# EAGLE design expansionBoard (EAGLE 7.7.0)
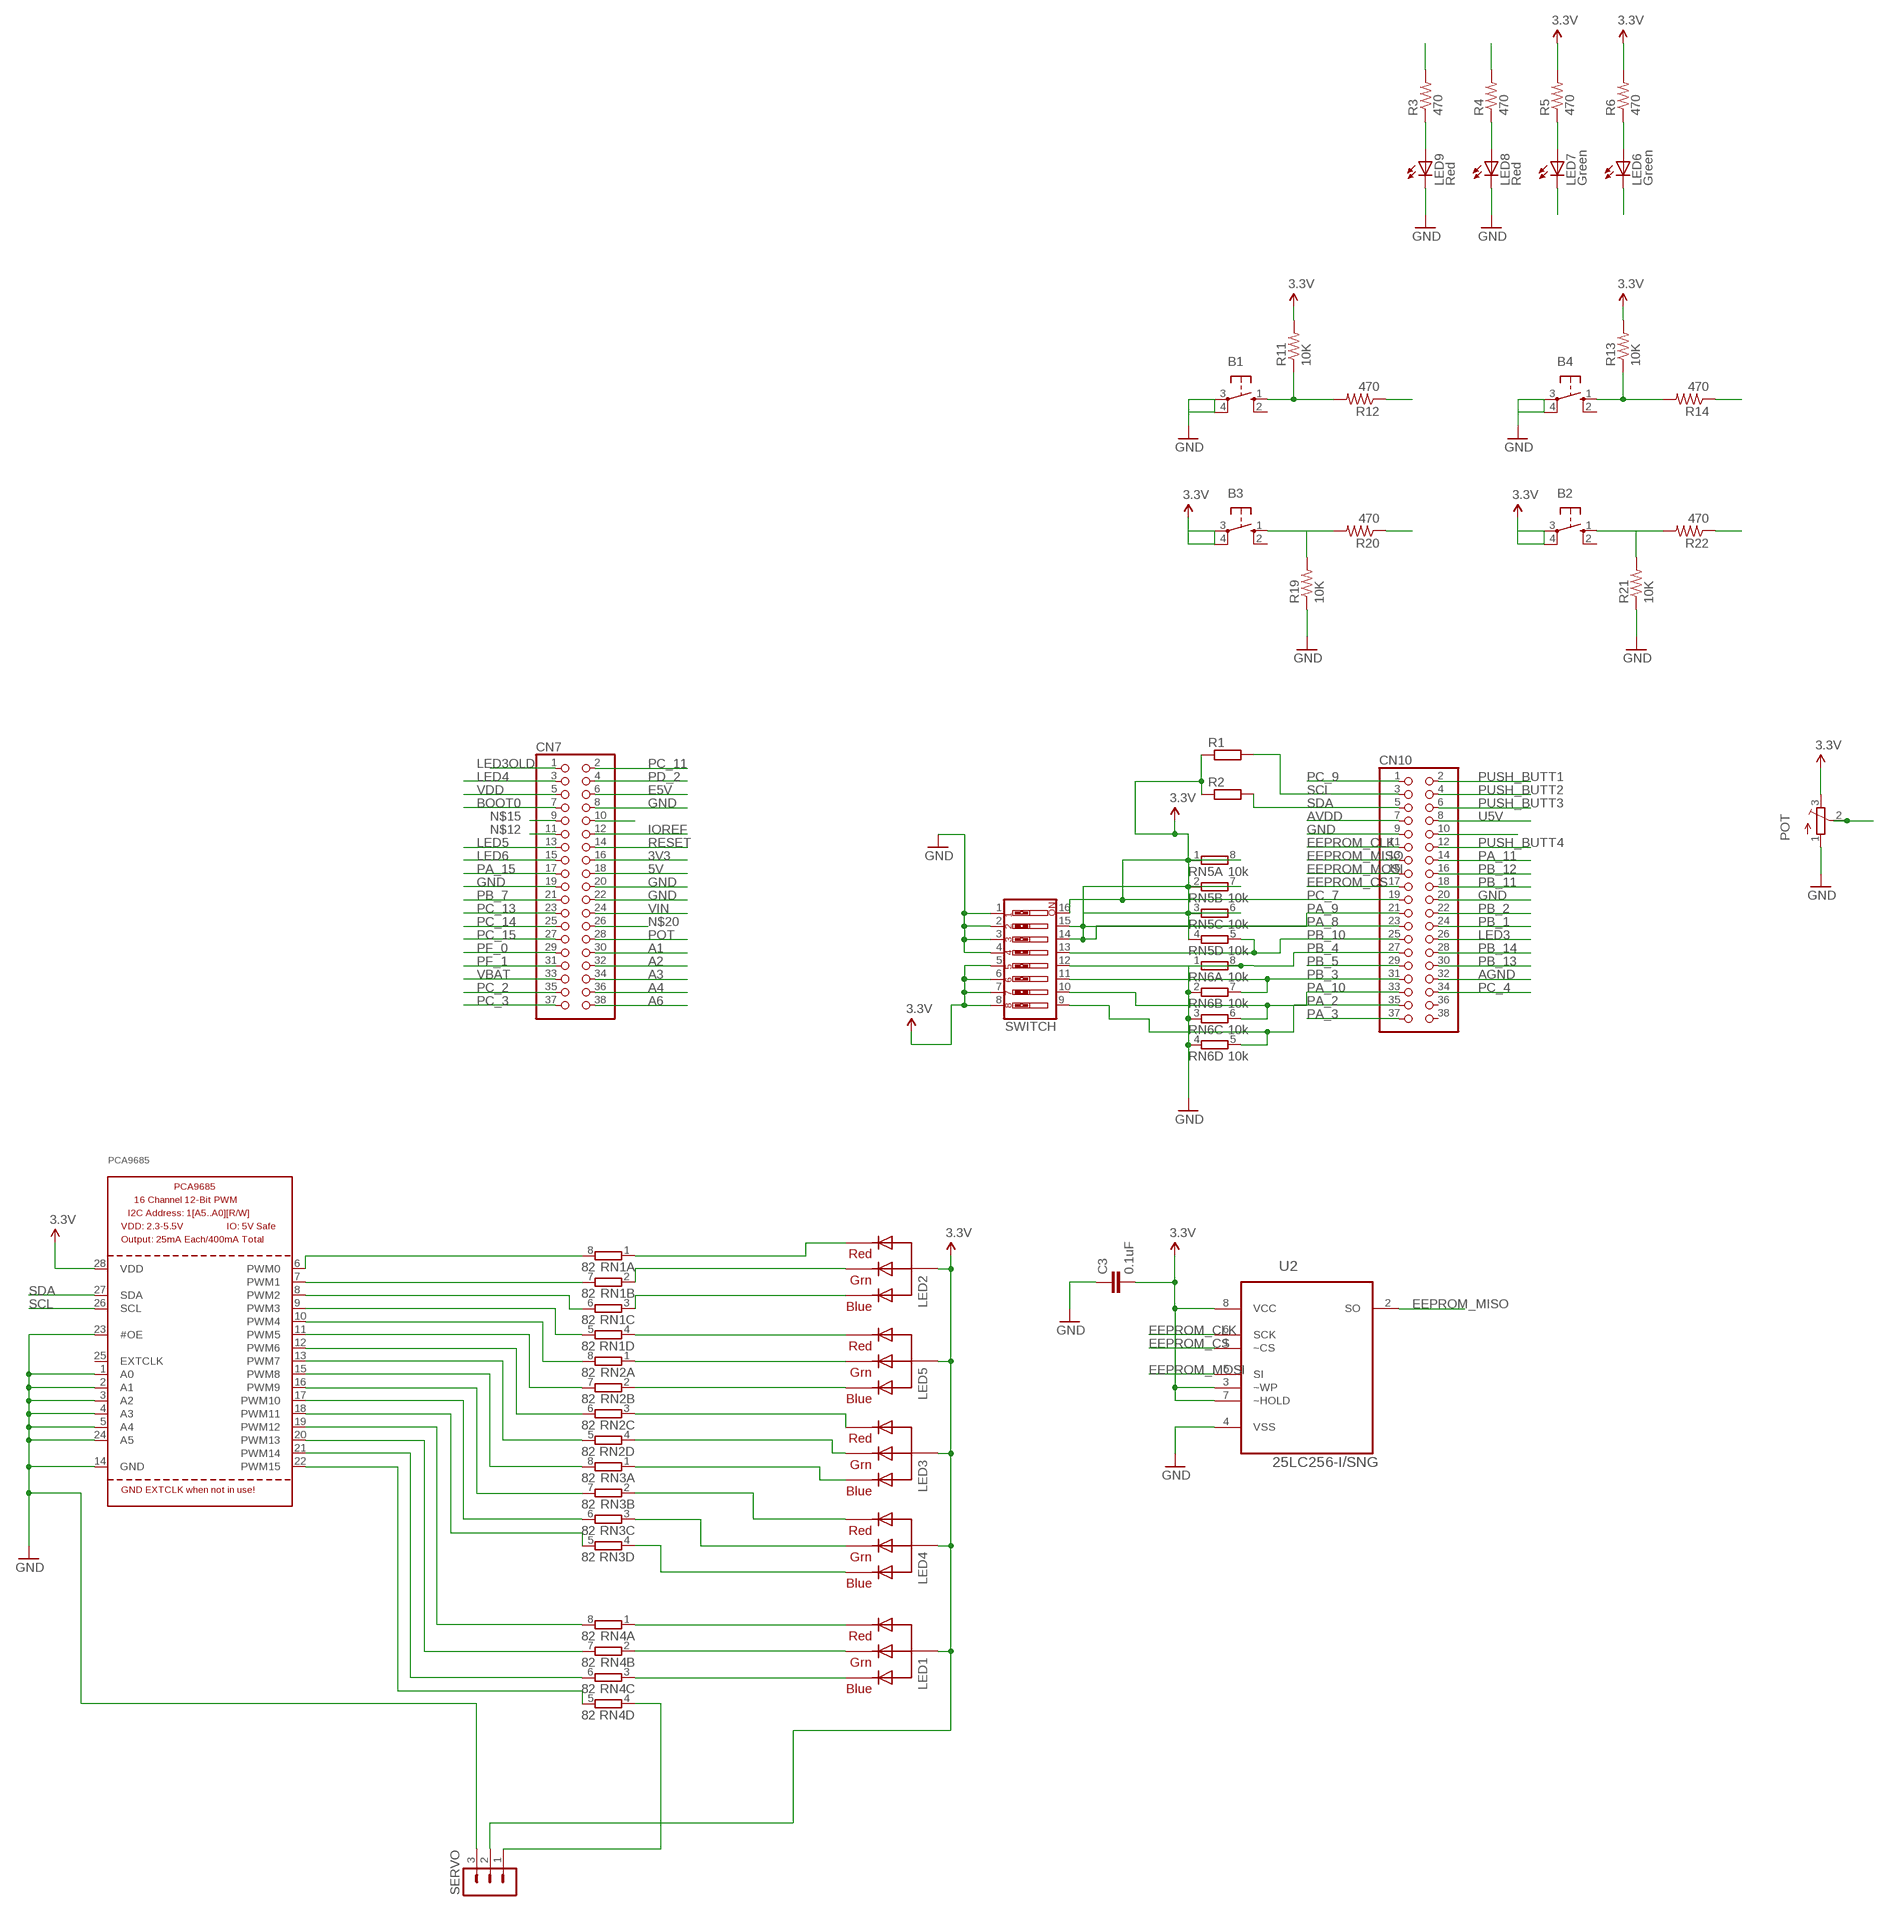
[diagram p0: schematic, sheet 1]

## Parts
B1  10-XX  [B3F-10XX]
B2  10-XX  [B3F-10XX]
B3  10-XX  [B3F-10XX]
B4  10-XX  [B3F-10XX]
C3  0.1uF  CAP0402-CAP  [0402-CAP]
CN7  PINHD-2X19  [2X19]
CN10  PINHD-2X19  [2X19]
LED1  RGBLED_CA-5MM  [LED5MMRGB]
LED2  RGBLED_CA-5MM  [LED5MMRGB]
LED3  RGBLED_CA-5MM  [LED5MMRGB]
LED4  RGBLED_CA-5MM  [LED5MMRGB]
LED5  RGBLED_CA-5MM  [LED5MMRGB]
LED6  Green  LED0603  [LED-0603]
LED7  Green  LED0603  [LED-0603]
LED8  Red  LED0603  [LED-0603]
LED9  Red  LED0603  [LED-0603]
PCA9685  PCA9685  [TSSOP28]
POT  TRIMPOT3386  [TRIM-3386]
R1  RR0603  [R0603]
R2  RR0603  [R0603]
R3  470  RESISTOR0402-RES  [0402-RES]
R4  470  RESISTOR0402-RES  [0402-RES]
R5  470  RESISTOR0402-RES  [0402-RES]
R6  470  RESISTOR0402-RES  [0402-RES]
R11  10K  RESISTOR0402-RES  [0402-RES]
R12  470  RESISTOR0402-RES  [0402-RES]
R13  10K  RESISTOR0402-RES  [0402-RES]
R14  470  RESISTOR0402-RES  [0402-RES]
R19  10K  RESISTOR0402-RES  [0402-RES]
R20  470  RESISTOR0402-RES  [0402-RES]
R21  10K  RESISTOR0402-RES  [0402-RES]
R22  470  RESISTOR0402-RES  [0402-RES]
RN1  82  4R-N0603-ARC  [0603-ARC]
RN2  82  4R-N0603-ARC  [0603-ARC]
RN3  82  4R-N0603-ARC  [0603-ARC]
RN4  82  4R-N0603-ARC  [0603-ARC]
RN5  10k  4R-N0603-ARC  [0603-ARC]
RN6  10k  4R-N0603-ARC  [0603-ARC]
SERVO  MA03-1  [MA03-1]
SWITCH  SW_DIP-8  [EDG-08]
U2  25LC256-I/SNG  [SOIC127P600X175-8N]

## Nets
3V3: CN7.16
5V: CN7.18
A1: CN7.30
A2: CN7.32
A3: CN7.34
A4: CN7.36
A6: CN7.38
AGND: CN10.32
AVDD: CN10.7
BOOT0: CN7.7
E5V: CN7.6
EEPROM_CLK: CN10.11 U2.6(SCK)
EEPROM_CS: CN10.17 U2.1(~CS)
EEPROM_MISO: CN10.13 U2.2(SO)
EEPROM_MOSI: CN10.15 U2.5(SI)
GND [power]: B1.3(P) B1.4(P1) B4.3(P) B4.4(P1) C3.1 CN7.8 CN7.19 CN7.20 CN7.22 CN10.9 CN10.20 LED8.C LED9.C PCA9685.1(A0) PCA9685.2(A1) PCA9685.3(A2) PCA9685.4(A3) PCA9685.5(A4) PCA9685.14(GND) PCA9685.23(#OE) PCA9685.24(A5) POT.1(A) R19.1 R21.1 RN6.1 RN6.2 RN6.3 RN6.4 SERVO.3 SWITCH.1 SWITCH.2 SWITCH.3 SWITCH.4 U2.4(VSS)
IOREF: CN7.12
LED3: CN10.26 R3.2
LED3OLD: CN7.1
LED4: CN7.3 R4.2
LED5: CN7.13 LED7.C
LED6: CN7.15 LED6.C
N$1: PCA9685.6(PWM0) RN1.8
N$2: PCA9685.7(PWM1) RN1.7
N$3: LED9.A R3.1
N$4: LED8.A R4.1
N$5: LED2.1(RED) RN1.1
N$6: PCA9685.8(PWM2) RN1.6
N$7: LED7.A R5.1
N$8: LED6.A R6.1
N$9: LED2.4(BLUE) RN1.3
N$10: PCA9685.9(PWM3) RN1.5
N$11: CN10.10
N$12: CN7.11
N$13: PCA9685.10(PWM4) RN2.8
N$14: PCA9685.11(PWM5) RN2.7
N$15: CN7.9
N$16: CN7.10
N$17: PCA9685.12(PWM6) RN2.6
N$18: PCA9685.13(PWM7) RN2.5
N$19: PCA9685.15(PWM8) RN3.8
N$20: CN7.26
N$21: PCA9685.16(PWM9) RN3.7
N$22: PCA9685.17(PWM10) RN3.6
N$23: PCA9685.18(PWM11) RN3.5
N$24: B4.1(S) R13.1 R14.2
N$25: B1.1(S) R11.1 R12.2
N$26: R14.1
N$27: R12.1
N$28: PCA9685.19(PWM12) RN4.8
N$29: PCA9685.20(PWM13) RN4.7
N$30: PCA9685.21(PWM14) RN4.6
N$31: LED2.3(GREEN) RN1.2
N$32: B3.1(S) R19.2 R20.2
N$33: R20.1
N$34: B2.1(S) R21.2 R22.2
N$35: R22.1
N$36: PCA9685.22(PWM15) RN4.5
N$37: RN4.4 SERVO.1
N$38: LED1.4(BLUE) RN4.3
N$39: LED1.3(GREEN) RN4.2
N$40: LED1.1(RED) RN4.1
N$41: LED5.1(RED) RN1.4
N$42: LED5.3(GREEN) RN2.1
N$43: LED5.4(BLUE) RN2.2
N$44: LED3.1(RED) RN2.3
N$45: LED3.3(GREEN) RN2.4
N$46: LED3.4(BLUE) RN3.1
N$47: LED4.1(RED) RN3.2
N$48: LED4.3(GREEN) RN3.3
N$49: LED4.4(BLUE) RN3.4
PA_2: CN10.35 RN6.5 SWITCH.9
PA_3: CN10.37
PA_8: CN10.23 RN5.6 SWITCH.14
PA_9: CN10.21 RN5.7 SWITCH.15
PA_10: CN10.33 RN6.6 SWITCH.10
PA_11: CN10.14
PA_15: CN7.17
PB_1: CN10.24
PB_2: CN10.22
PB_3: CN10.31 RN6.7 SWITCH.11
PB_4: CN10.27 RN6.8 SWITCH.12
PB_5: CN10.29
PB_7: CN7.21
PB_10: CN10.25 RN5.5 SWITCH.13
PB_11: CN10.18
PB_12: CN10.16
PB_13: CN10.30
PB_14: CN10.28
PC_2: CN7.35
PC_3: CN7.37
PC_4: CN10.34
PC_7: CN10.19 RN5.8 SWITCH.16
PC_9: CN10.1
PC_11: CN7.2
PC_13: CN7.23
PC_14: CN7.25
PC_15: CN7.27
PD_2: CN7.4
PF_0: CN7.29
PF_1: CN7.31
POT: CN7.28 POT.2(S)
PUSH_BUTT1: CN10.2
PUSH_BUTT2: CN10.4
PUSH_BUTT3: CN10.6
PUSH_BUTT4: CN10.12
RESET: CN7.14
SCL: CN10.3 PCA9685.26(SCL) R1.2
SDA: CN10.5 PCA9685.27(SDA) R2.2
U5V: CN10.8
VBAT: CN7.33
VCC: B2.3(P) B2.4(P1) B3.3(P) B3.4(P1) C3.2 LED1.2(VCC) LED2.2(VCC) LED3.2(VCC) LED4.2(VCC) LED5.2(VCC) PCA9685.28(VDD) POT.3(E) R1.1 R2.1 R5.2 R6.2 R11.2 R13.2 RN5.1 RN5.2 RN5.3 RN5.4 SERVO.2 SWITCH.5 SWITCH.6 SWITCH.7 SWITCH.8 U2.3(~WP) U2.7(~HOLD) U2.8(VCC) ; supply symbol labelled 3.3V
VDD: CN7.5
VIN: CN7.24
Unconnected: B1.2(S1) B2.2(S1) B3.2(S1) B4.2(S1) CN10.36 CN10.38 PCA9685.25(EXTCLK)

## Library data of the parts
B1-B4 = switch-omron:10-XX: OMRON SWITCH; MPN: B3F-1000; OC_FARNELL: 176432; OC_NEWARK: 36M3542
C3 = SparkFun:CAP: Capacitor Standard 0603 ceramic capacitor, and 0.1" leaded capacitor.
CN7 CN10 = pinhead:PINHD-2X19: PIN HEADER
LED1-LED5 = NucleoShield:RGBLED_CA: RGB LED, common-anode 5MM Staggered pins 5mm Piranha package http://www.ladyada.net/library/pcb/eaglelibrary.html
LED6-LED9 = SparkFun:LED: LEDs Standard schematic elements and footprints for 5mm, 3mm, 1206, and 0603 sized LEDs. 5mm - Spark Fun Electronics SKU : COM-00529 (and others)
PCA9685 = NucleoShield:PCA9685: PCA9685 - 16 Channel 12-Bit I2C PWM Controller 5.0V tolerant 16 channel, 12-bit I2C PWM controller with 25mA per output (max. 400mA total) Digikey: 568-5931-1-ND
POT = NucleoShield:TRIMPOT: SMT trimmer potentiometer part number TC33X http://www.ladyada.net/library/eagle
R1 R2 = eagle-ltspice:R: RESISTOR, European symbol; SPICEMODEL: NONE; SPICEPREFIX: R
R3-R6 R11-R14 R19-R22 = SparkFun:RESISTOR: Resistor Basic schematic elements and footprints for 0603, 1206, and PTH resistors.
RN1-RN6 = resistor-dil:4R-N: Array Chip Resistor Source: RS Component / Phycomp; OC_FARNELL: unknown; OC_NEWARK: unknown
SERVO = con-lstb:MA03-1: PIN HEADER; OC_FARNELL: unknown; OC_NEWARK: unknown
SWITCH = special:SW_DIP-8: DIP SWITCH
U2 = Microchip_By_element14_Batch_1:25LC256-I/SNG: 256K SPI Bus Serial EEPROM; DESCRIPTION: EEPROM; MPN: 25LC256-I/SNG; OC_FARNELL: -; OC_NEWARK: 92C7460; PACKAGE: SOIC-8; SUPPLIER: Microchip

## Net classes
0 default: width 0.152 mm
1 power: width 0.254 mm

## Board
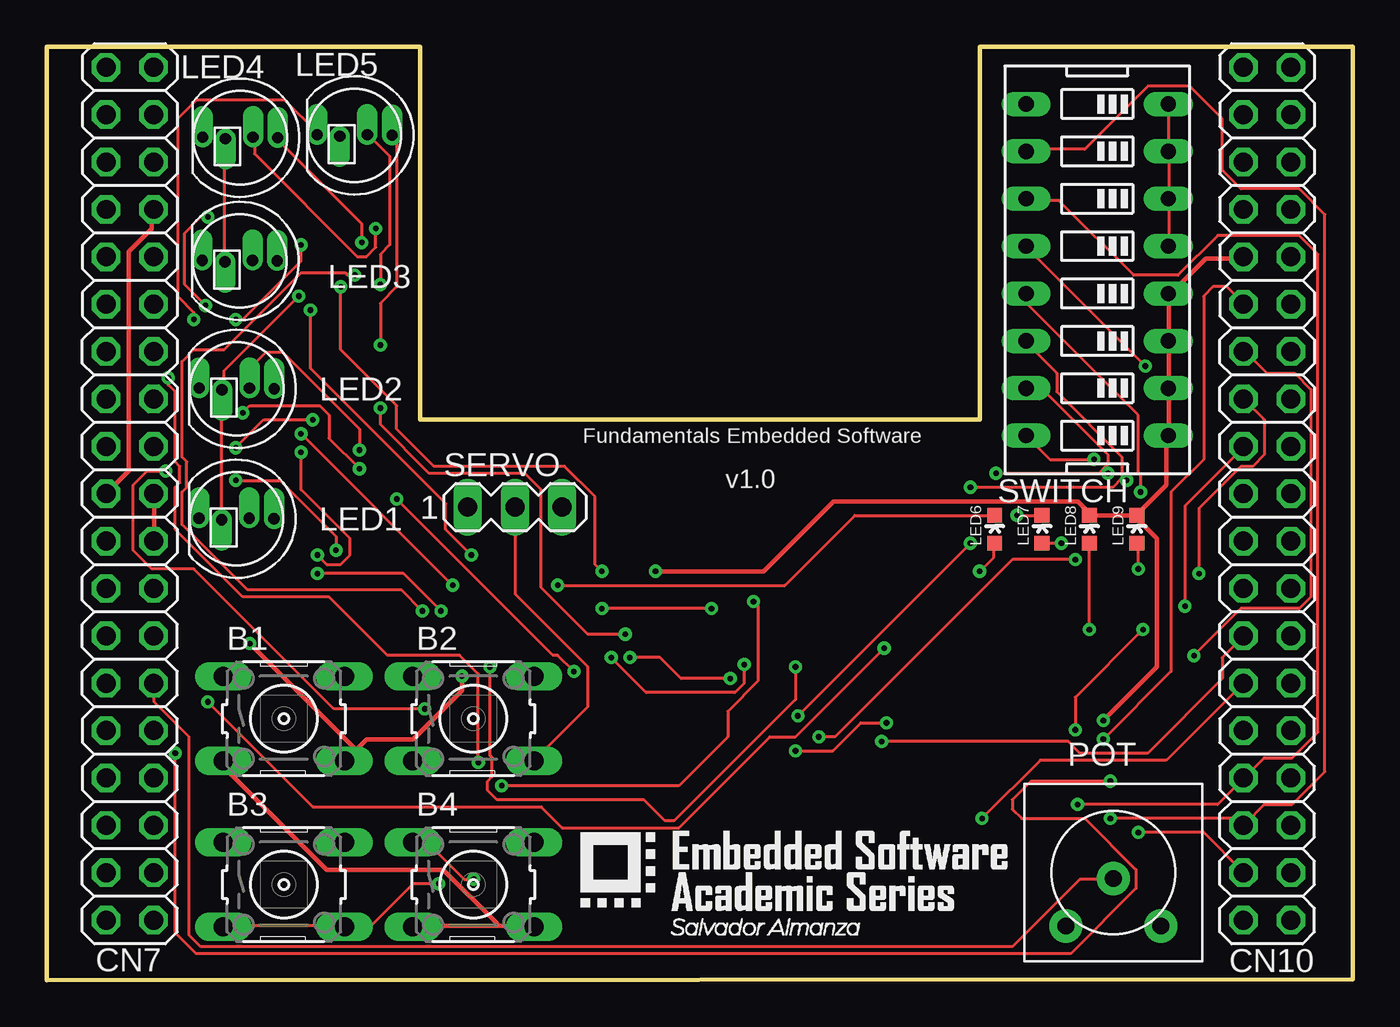
[diagram p1: board, top side]
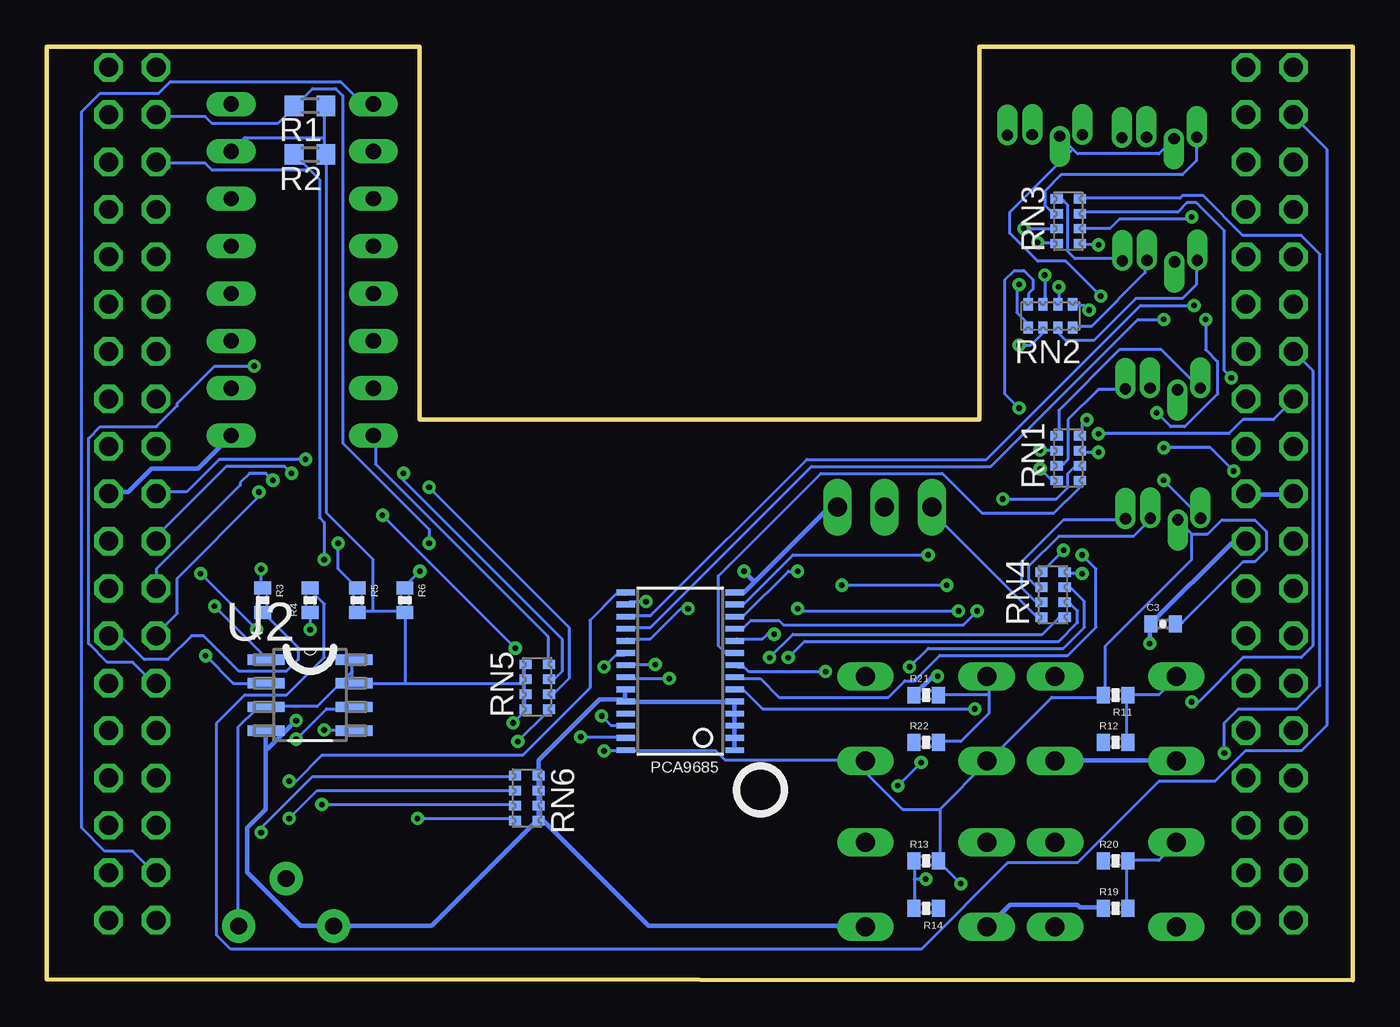
[diagram p2: board, bottom side, seen from below]

Size 70.01 x 50.04 mm. Coordinates in mm from the lower left corner, seen from the top.
Outline: 0,0 0.01,50.04 20.01,50.04 20.01,30.04 50.01,30.04 50.01,50.04 70.01,50.04 70.01,0.04 0,0
Copper layers (1*16): Top 0.035mm / dielectric 1.5mm / Bottom 0.035mm
Design rules "pcbway": minimum track width 6mil, minimum drill 0.3mm, track to track 0.205mm, track to pad 0.205mm, pad to pad 0.205mm, via to via 0.205mm, smd to smd 8mil, copper to edge 40mil, drill to drill 8mil, minimum pad ring 10mil, minimum via ring 8mil, stop-mask expansion 4mil, vias tented up to drill 25mil, thermal gap 10mil

### Footprints (pad centres in the part's own frame; a part is rotated, then mirrored left to right if it is on the bottom)
B3F-10XX = drill 1.016 long: 1 -3.251,2.261; 2 3.251,2.261; 3 -3.251,-2.261; 4 3.251,-2.261
0402-CAP = smd 0.7 x 0.9: 1 -0.65,0; 2 0.65,0
2X19 = drill 1.016 octagon: 1 -22.86,-1.27; 2 -22.86,1.27; 3 -20.32,-1.27; 4 -20.32,1.27; 5 -17.78,-1.27; 6 -17.78,1.27; 7 -15.24,-1.27; 8 -15.24,1.27; 9 -12.7,-1.27; 10 -12.7,1.27; 11 -10.16,-1.27; 12 -10.16,1.27; 13 -7.62,-1.27; 14 -7.62,1.27; 15 -5.08,-1.27; 16 -5.08,1.27; 17 -2.54,-1.27; 18 -2.54,1.27; 19 0,-1.27; 20 0,1.27; 21 2.54,-1.27; 22 2.54,1.27; 23 5.08,-1.27; 24 5.08,1.27; 25 7.62,-1.27; 26 7.62,1.27; 27 10.16,-1.27; 28 10.16,1.27; 29 12.7,-1.27; 30 12.7,1.27; 31 15.24,-1.27; 32 15.24,1.27; 33 17.78,-1.27; 34 17.78,1.27; 35 20.32,-1.27; 36 20.32,1.27; 37 22.86,-1.27; 38 22.86,1.27
LED5MMRGB = drill 0.6 pad 0.813 offset: 1 -2.009,0.033; 2 -0.785,-0.048; 3 0.689,0.033; 4 2.013,0.002
LED-0603 = smd 0.8 x 0.8: A 0,-0.75; C 0,0.75
TSSOP28 = smd 0.305 x 0.991: 1 -4.225,-2.918; 2 -3.575,-2.918; 3 -2.925,-2.918; 4 -2.275,-2.918; 5 -1.625,-2.918; 6 -0.975,-2.918; 7 -0.325,-2.918; 8 0.325,-2.918; 9 0.975,-2.918; 10 1.625,-2.918; 11 2.275,-2.918; 12 2.925,-2.918; 13 3.575,-2.918; 14 4.225,-2.918; 15 4.225,2.918; 16 3.575,2.918; 17 2.925,2.918; 18 2.275,2.918; 19 1.625,2.918; 20 0.975,2.918; 21 0.325,2.918; 22 -0.325,2.918; 23 -0.975,2.918; 24 -1.625,2.918; 25 -2.275,2.918; 26 -2.925,2.918; 27 -3.575,2.918; 28 -4.225,2.918
TRIM-3386 = drill 0.9 pad 1.778: 1 -2.54,-2.857; 2 0,-0.318; 3 2.54,-2.857
R0603 = smd 1 x 1.1: 1 -0.85,0; 2 0.85,0
0402-RES = smd 0.7 x 0.9: 1 -0.65,0; 2 0.65,0
0603-ARC = smd 0.5 x 0.65: 1 -1.2,-0.625; 2 -0.4,-0.625; 3 0.4,-0.625; 4 1.2,-0.625; 5 1.2,0.625; 6 0.4,0.625; 7 -0.4,0.625; 8 -1.2,0.625
MA03-1 = drill 1.016 long: 1 -2.54,0; 2 0,0; 3 2.54,0
EDG-08 = drill 0.813 long: 1 -8.89,-3.81; 2 -6.35,-3.81; 3 -3.81,-3.81; 4 -1.27,-3.81; 5 1.27,-3.81; 6 3.81,-3.81; 7 6.35,-3.81; 8 8.89,-3.81; 9 8.89,3.81; 10 6.35,3.81; 11 3.81,3.81; 12 1.27,3.81; 13 -1.27,3.81; 14 -3.81,3.81; 15 -6.35,3.81; 16 -8.89,3.81
SOIC127P600X175-8N = smd 1.981 x 0.559: 1 -2.362,1.905; 2 -2.362,0.635; 3 -2.362,-0.635; 4 -2.362,-1.905; 5 2.362,-1.905; 6 2.362,-0.635; 7 2.362,0.635; 8 2.362,1.905

### Placement (x,y rotation side)
B1  12.71,14.01 0 top
B2  22.87,14.01 0 top
B3  12.71,5.12 0 top
B4  22.87,5.12 0 top
C3  10.17,19.09 0 bottom
CN7  4.46,26.07 270 top
CN10  65.42,26.07 270 top
LED1  10.17,24.73 0 top
LED2  10.18,31.69 0 top
LED3  10.34,38.55 0 top
LED4  10.37,45.16 0 top
LED5  16.5,45.28 0 top
LED6  50.81,24.17 0 top
LED7  53.35,24.17 0 top
LED8  55.89,24.17 0 top
LED9  58.43,24.17 0 top
PCA9685  36.05,16.56 90 bottom
POT  57.17,5.76 0 top
R1  55.89,46.87 180 bottom
R2  55.89,44.25 180 bottom
R3  58.43,20.36 270 bottom
R4  55.89,20.36 90 bottom
R5  53.35,20.36 270 bottom
R6  50.81,20.36 270 bottom
R11  12.71,15.28 180 bottom
R12  12.71,12.74 0 bottom
R13  22.87,6.39 0 bottom
R14  22.87,3.85 180 bottom
R19  12.71,3.85 0 bottom
R20  12.71,6.39 0 bottom
R21  22.87,15.28 0 bottom
R22  22.87,12.74 0 bottom
RN1  15.25,27.98 270 bottom
RN2  16.21,35.6 0 bottom
RN3  15.25,40.68 270 bottom
RN4  16.07,20.66 270 bottom
RN5  43.71,15.72 270 bottom
RN6  44.27,9.75 90 bottom
SERVO  25.1,25.35 0 top
SWITCH  56.31,38.07 90 top
U2  55.89,15.28 0 bottom

### Tracks (layer width: path | path; a pad name or v marks a point on that pad's centre or on a via)
EEPROM_CLK  (via drill 0.3)
  Top 0.152: v56.64,12.91 60.26,16.54 60.26,26.16 62.01,27.91 62.01,36.66 62.51,37.16 63.26,37.16 64.14,36.29 CN10.11
  Bottom 0.152: v56.64,12.91 55.01,14.54 53.64,14.54 U2.6
EEPROM_CS  (via drill 0.3)
  Top 0.152: v61.01,20.04 61.01,25.41 64.14,28.54 CN10.17
  Bottom 0.152: v61.01,20.04 58.26,17.29 U2.1
EEPROM_MISO  (via drill 0.3)
  Top 0.152: v61.49,17.39 64.01,19.91 67.14,19.91 67.76,20.54 67.76,31.66 66.89,32.54 65.39,32.54 64.26,33.66 CN10.13
  Bottom 0.152: U2.2 60.01,15.91 v61.49,17.39
EEPROM_MOSI  (via drill 0.3)
  Top 0.152: v55.14,13.41 55.14,15.16 v58.76,18.79 | v61.76,21.79 61.76,25.29 64.01,27.54 64.64,27.54 65.26,28.16 65.26,30.04 CN10.15
  Bottom 0.152: v55.14,13.41 53.64,13.41 U2.5 | v61.76,21.79 v58.76,18.79
GND  (via drill 0.3)
  Top 0.254: CN10.9 64.14,38.66 62.14,38.66 60.26,36.79 SWITCH.4 60.14,36.79 60.14,34.29 SWITCH.3 60.14,34.16 60.14,31.79 SWITCH.2 60.14,31.66 60.14,29.29 SWITCH.1 60.01,29.16 60.01,26.54 58.51,25.04 LED9.C | LED9.C 58.39,24.91 56.01,24.91 LED8.C 55.89,25.04 55.26,25.66 42.18,25.66 38.43,21.91 v32.64,21.91 | CN7.8 5.64,41.29 5.64,40.29 4.39,39.04 4.39,27.29 3.26,26.16 CN7.19 | CN7.22 5.76,23.54 5.76,26.04 CN7.20 | v22.26,16.29 22.26,15.54 19.64,12.91 17.14,12.91 16.01,11.79 B1.4 16.51,12.41 v10.89,18.04 | 24.14,2.91 19.64,2.91 B4.3 | 24.14,2.91 26.01,2.91 B4.4 | B1.3 9.51,11.66 9.51,11.41 15.01,5.91 21.26,5.91 24.14,3.04 24.14,2.91 | v56.64,13.91 59.51,16.79 59.51,23.66 58.39,24.79 LED9.C
  Bottom 0.254: 32.07,21.35 28.14,25.29 27.64,25.29 SERVO.3 | 32.07,21.35 32.64,20.79 33.01,20.79 PCA9685.14 | CN10.20 66.64,26.16 65.64,26.16 64.39,27.41 61.89,27.41 60.14,29.16 SWITCH.1 | v32.64,21.91 32.07,21.35 | CN7.22 5.76,23.41 6.51,23.41 10.76,19.16 C3.1 10.89,19.04 v10.89,18.04 | CN7.19 3.26,26.04 5.64,26.04 CN7.20 | R21.1 22.51,16.29 v22.26,16.29 | B1.3 9.51,11.79 15.89,11.79 B1.4 | R19.1 13.39,3.91 14.64,3.91 14.76,4.04 18.39,4.04 19.51,2.91 B4.3 | RN6.1 43.64,8.66 43.64,9.29 RN6.2 43.64,9.41 43.64,10.04 RN6.3 43.64,10.91 RN6.4 43.64,11.04 43.64,11.79 40.39,15.04 39.14,15.04 PCA9685.24 | PCA9685.24 39.01,15.04 39.01,15.54 PCA9685.23 | PCA9685.1 33.14,12.41 33.14,12.91 PCA9685.2 33.14,13.04 33.14,13.54 PCA9685.3 33.14,13.66 33.14,14.16 PCA9685.4 33.14,14.91 PCA9685.5 33.26,14.91 38.89,14.91 PCA9685.24 | 58.26,12.41 58.26,9.16 59.26,8.16 59.26,5.79 56.39,2.91 54.64,2.91 POT.1 54.51,2.91 49.39,2.91 43.76,8.54 RN6.1 | 58.26,12.41 58.26,13.29 U2.4 | B4.4 26.14,2.91 37.76,2.91 43.51,8.66 RN6.1 | v56.64,13.91 58.14,12.41 58.26,12.41
LED3
  Bottom 0.152: R3.2 58.42,19.71 56.53,17.82 56.53,17.18 57.16,16.55 59.7,16.55 61.61,18.45 62.24,18.45 63.51,17.18 64.78,17.18 66.05,18.45 CN10.26
LED4
  Bottom 0.152: R4.2 55.89,20.91 55.14,20.16 55.14,17.29 57.14,15.29 59.39,15.29 60.89,13.79 60.89,2.41 60.14,1.66 23.14,1.66 18.51,6.29 14.76,6.29 10.39,10.66 7.39,10.66 5.76,12.29 2.76,12.29 1.39,13.66 1.39,44.54 3.14,46.29 CN7.3
LED5  (via drill 0.3)
  Top 0.152: v52.01,24.91 53.26,24.91 LED7.C | v44.89,17.79 40.14,13.04 38.76,13.04 33.89,8.16 27.64,8.16 26.51,9.29 14.26,9.29 v8.64,14.91
  Bottom 0.152: v44.89,17.79 v52.01,24.91 | v8.64,14.91 8.26,14.91 5.89,17.29 2.76,17.29 2.14,17.91 2.14,32.66 3.14,33.66 CN7.13
LED6  (via drill 0.3)
  Top 0.152: v27.39,21.16 39.57,21.16 43.32,24.91 50.76,24.91 LED6.C | v13.64,29.29 v21.76,21.16
  Bottom 0.152: v21.76,21.16 v27.39,21.16 | v13.64,29.29 6.64,29.29 5.89,30.04 4.26,30.04 3.26,31.04 CN7.15
N$1  (via drill 0.3)
  Top 0.152: v14.26,30.04 11.64,30.04 v10.14,28.54 | v6.39,27.29 5.39,27.29 4.64,26.54 4.64,23.04 5.64,22.04 7.89,22.04 15.39,14.54 v20.26,14.54
  Bottom 0.152: v14.26,30.04 14.51,29.79 14.51,29.29 RN1.8 | v10.14,28.54 7.64,28.54 v6.39,27.29 | v20.26,14.54 31.64,14.54 32.64,15.54 33.01,15.54 PCA9685.6
N$2  (via drill 0.3)
  Top 0.152: v13.64,28.29 13.64,26.29 16.26,23.66 16.26,22.79 15.76,22.29 15.01,22.29 v14.51,22.79
  Bottom 0.152: v13.64,28.29 14.51,28.29 RN1.7 | v14.51,22.79 13.76,22.04 13.76,18.91 15.26,17.41 22.14,17.41 23.51,16.04 24.01,16.04 24.89,15.16 30.76,15.16 31.76,16.16 33.01,16.16 PCA9685.7
N$3  (via drill 0.3)
  Top 0.152: v58.51,22.04 58.51,23.41 LED9.A
  Bottom 0.152: v58.51,22.04 58.51,21.04 R3.1
N$4  (via drill 0.3)
  Top 0.152: v55.89,18.79 LED8.A
  Bottom 0.152: v55.89,18.79 55.89,19.66 R4.1
N$5
  Bottom 0.152: RN1.1 15.76,29.29 15.76,30.54 12.51,33.79 10.26,33.79 8.26,31.79 LED2.1
N$6  (via drill 0.3)
  Top 0.152: v18.76,25.79 27.14,17.41 27.39,17.41 v28.26,16.54
  Bottom 0.152: v18.76,25.79 15.89,25.79 15.26,26.41 15.26,27.16 14.89,27.54 14.64,27.54 RN1.6 | v28.26,16.54 32.39,16.54 32.64,16.79 33.01,16.79 PCA9685.8
N$7  (via drill 0.3)
  Top 0.152: v54.39,23.41 53.39,23.41 LED7.A
  Bottom 0.152: v54.39,23.41 54.39,22.04 53.39,21.04 R5.1
N$8  (via drill 0.3)
  Top 0.152: v50.01,21.91 50.76,22.66 50.76,23.41 LED6.A
  Bottom 0.152: v50.01,21.91 50.89,21.04 R6.1
N$9
  Bottom 0.152: RN1.3 15.76,27.66 15.51,27.66 15.26,27.91 15.26,30.04 13.64,31.66 12.26,31.66 LED2.4
N$10
  Bottom 0.152: RN1.5 14.64,26.66 14.64,26.41 16.01,25.04 19.89,25.04 22.01,27.16 28.51,27.16 34.01,21.66 34.01,17.91 33.64,17.54 PCA9685.9
N$13  (via drill 0.3)
  Top 0.152: v17.89,30.66 17.89,29.79 20.51,27.16 25.64,27.16 26.51,26.29 26.51,21.04 29.01,18.54 v31.01,18.54
  Bottom 0.152: v17.89,30.66 18.64,31.41 18.64,37.54 18.14,38.04 17.64,38.04 17.14,37.54 17.14,37.04 17.39,36.79 17.39,36.29 RN2.8 | v31.01,18.54 31.39,18.54 31.64,18.29 33.01,18.29 PCA9685.10
N$14  (via drill 0.3)
  Top 0.152: v16.51,37.79 16.14,37.79 16.01,37.91 13.64,37.91 9.51,33.79 7.89,33.79 7.26,33.16 7.26,28.04 7.51,27.79 7.51,26.41 7.26,26.16 7.26,24.41 10.76,20.91 19.01,20.91 v20.14,19.79
  Bottom 0.152: v16.51,37.79 16.51,36.29 RN2.7 | v20.14,19.79 20.89,19.04 30.51,19.04 30.76,19.29 32.26,19.29 32.64,18.91 33.01,18.91 PCA9685.11
N$17  (via drill 0.3)
  Top 0.152: v15.76,37.16 15.76,33.79 18.76,30.79 18.76,29.54 20.76,27.54 27.76,27.54 29.39,25.91 29.39,22.29 v29.76,21.91
  Bottom 0.152: v15.76,37.16 15.76,36.29 RN2.6 | v29.76,21.91 30.26,21.91 32.64,19.54 33.01,19.54 PCA9685.12
N$18  (via drill 0.3)
  Top 0.152: v14.14,35.91 14.14,32.79 21.39,25.54 21.39,24.16 v22.76,22.79
  Bottom 0.152: v14.14,35.91 14.39,36.16 15.01,36.16 RN2.5 | v22.76,22.79 30.01,22.79 32.64,20.16 33.01,20.16 PCA9685.13
N$19  (via drill 0.3)
  Top 0.152: v6.89,12.16 6.89,2.54 8.01,1.41 54.89,1.41 58.39,4.91 58.39,5.91 55.64,8.66 52.26,8.66 51.76,9.16 51.76,9.66 52.76,10.66 v57.01,10.66
  Bottom 0.152: v6.89,12.16 6.89,13.79 6.14,14.54 3.01,14.54 1.76,15.79 1.76,38.91 2.76,39.91 5.89,39.91 8.01,42.04 9.14,42.04 9.26,41.91 14.51,41.91 RN3.8 | v57.01,10.66 56.64,10.66 55.26,12.04 44.51,12.04 40.89,15.66 40.89,19.29 39.51,20.66 39.01,20.66 PCA9685.15
N$21  (via drill 0.3)
  Top 0.152: v6.51,32.29 6.51,31.91 6.89,31.54 6.89,27.79 7.14,27.54 7.14,26.66 6.89,26.41 6.89,24.16 10.51,20.54 15.14,20.54 18.26,17.41 22.14,17.41 23.14,16.41 v23.14,11.66 | v24.39,10.41 33.89,10.41 36.51,13.04 36.51,14.41 38.14,16.04 38.14,20.04 v37.89,20.29
  Bottom 0.152: v6.51,32.29 6.89,32.66 6.89,40.16 8.39,41.66 8.89,41.66 9.39,41.16 14.51,41.16 RN3.7 | v24.39,10.41 v23.14,11.66 | v37.89,20.29 38.76,20.29 38.89,20.16 PCA9685.16
N$22  (via drill 0.3)
  Top 0.152: v8.64,40.91 8.26,40.91 7.39,40.04 7.39,37.29 v8.51,36.16
  Bottom 0.152: v8.64,40.91 8.76,40.79 12.51,40.79 13.01,40.29 14.51,40.29 RN3.6 | v8.51,36.16 11.39,36.16 19.64,27.91 29.26,27.91 37.64,19.54 38.89,19.54 PCA9685.17
N$23  (via drill 0.3)
  Top 0.152: v13.64,39.41 13.64,38.54 10.51,35.41 v10.14,35.41
  Bottom 0.152: v13.64,39.41 14.51,39.41 RN3.5 | v10.14,35.41 11.51,35.41 19.39,27.54 29.01,27.54 37.64,18.91 38.89,18.91 PCA9685.18
N$24  (via drill 0.3)
  Top 0.152: v22.89,5.41 22.39,5.41 20.51,7.29 19.64,7.29 B4.1
  Bottom 0.152: 23.51,5.41 23.51,6.29 R13.1 | 23.51,5.41 23.51,3.91 R14.2 | v22.89,5.41 23.51,5.41
N$25
  Bottom 0.152: R12.2 12.14,12.79 12.14,15.16 R11.1 12.01,15.29 10.39,15.29 9.51,16.16 B1.1
N$28  (via drill 0.3)
  Top 0.152: v14.51,21.79 19.14,21.79 v21.14,19.79 | v35.64,19.91 v29.76,19.91
  Bottom 0.152: v14.51,21.79 15.39,21.79 RN4.8 | v21.14,19.79 29.64,19.79 v29.76,19.91 | v35.64,19.91 36.01,19.91 37.64,18.29 38.89,18.29 PCA9685.19
N$29  (via drill 0.3)
  Top 0.152: v23.76,16.79 23.76,12.04 23.89,11.91 23.89,10.91 23.64,10.66 23.64,10.16 24.14,9.66 32.01,9.66 33.14,8.54 33.64,8.54 40.14,15.04 v40.14,16.79
  Bottom 0.152: v23.76,16.79 22.76,17.79 15.51,17.79 14.39,18.91 14.39,20.29 15.14,21.04 15.39,21.04 RN4.7 | v40.14,16.79 39.51,17.41 39.01,17.41 PCA9685.20
N$30  (via drill 0.3)
  Top 0.152: v30.26,17.29 32.14,15.41 36.89,15.41 37.39,15.91 v37.39,16.91
  Bottom 0.152: v30.26,17.29 29.39,18.16 15.76,18.16 14.76,19.16 14.76,19.79 15.14,20.16 15.39,20.16 RN4.6 | v37.39,16.91 38.89,16.91 PCA9685.21
N$31  (via drill 0.3)
  Top 0.152: v16.76,28.41 16.76,29.54 12.64,33.66 11.76,33.66 10.89,32.79 10.89,31.79 LED2.3
  Bottom 0.152: v16.76,28.41 15.89,28.41 RN1.2
N$32
  Bottom 0.152: R19.2 12.14,3.91 12.14,6.29 R20.2 12.01,6.41 10.39,6.41 9.51,7.29 B3.1
N$34
  Bottom 0.152: 19.51,15.29 19.51,16.16 B2.1 | 19.51,15.29 19.51,14.29 21.01,12.79 22.14,12.79 R22.2 | 19.51,15.29 22.14,15.29 R21.2
N$36  (via drill 0.3)
  Top 0.152: v31.26,17.29 32.89,17.29 34.01,16.16 v36.64,16.16
  Bottom 0.152: v31.26,17.29 30.01,18.54 16.64,18.54 15.76,19.41 15.51,19.41 RN4.5 | v36.64,16.16 38.89,16.16 PCA9685.22
N$37
  Bottom 0.152: RN4.4 16.76,19.54 17.01,19.54 22.51,25.04 22.51,25.29 SERVO.1
N$38
  Bottom 0.152: RN4.3 16.76,20.29 17.01,20.29 17.76,21.04 17.76,22.41 15.51,24.66 12.26,24.66 LED1.4
N$39
  Bottom 0.152: RN4.2 16.76,21.16 17.01,21.16 17.39,21.54 17.39,22.16 15.76,23.79 11.76,23.79 10.89,24.66 LED1.3
N$40  (via drill 0.3)
  Top 0.152: v15.51,23.04 15.51,23.79 12.51,26.79 v10.14,26.79
  Bottom 0.152: v15.51,23.04 16.64,21.91 RN4.1 | v10.14,26.79 8.14,24.79 LED1.1
N$41  (via drill 0.3)
  Top 0.152: v16.76,27.41 15.14,29.04 15.14,30.29 14.64,30.79 10.89,30.79 v10.51,30.41 | v7.89,35.41 7.89,35.79 7.01,36.66 7.01,46.16 8.01,47.16 12.76,47.16 14.51,45.41 LED5.1
  Bottom 0.152: v16.76,27.41 16.14,26.79 RN1.4 | v10.51,30.41 9.76,29.66 9.01,29.66 7.26,31.41 7.26,33.16 7.89,33.79 v7.89,35.41
N$42  (via drill 0.3)
  Top 0.152: v17.89,37.29 17.89,38.91 18.39,39.41 18.39,44.16 17.26,45.29 LED5.3
  Bottom 0.152: v17.89,37.29 18.01,37.16 18.01,35.79 17.51,35.29 17.51,35.04 RN2.1
N$43  (via drill 0.3)
  Top 0.152: v17.89,34.04 17.89,36.29 18.76,37.16 18.76,44.91 18.51,45.16 LED5.4
  Bottom 0.152: v17.89,34.04 17.26,34.04 16.64,34.66 16.64,34.91 RN2.2
N$44
  Bottom 0.152: RN2.3 15.76,34.91 15.76,34.66 15.39,34.29 13.89,34.29 11.64,36.54 9.14,36.54 8.39,37.29 8.39,38.54 LED3.1
N$45
  Bottom 0.152: RN2.4 15.01,35.04 14.01,35.04 11.14,37.91 11.14,38.54 LED3.3
N$46
  Bottom 0.152: RN3.1 15.76,41.79 15.51,41.79 15.26,41.54 15.26,39.04 14.89,38.66 12.39,38.66 LED3.4
N$47
  Bottom 0.152: RN3.2 15.89,41.16 16.14,41.16 16.51,41.54 16.51,42.29 15.64,43.16 9.14,43.16 8.39,43.91 8.39,45.16 LED4.1
N$48  (via drill 0.3)
  Top 0.152: v17.64,40.29 17.64,39.29 17.14,38.79 16.64,38.79 11.14,44.29 11.14,45.16 LED4.3
  Bottom 0.152: v17.64,40.29 RN3.3
N$49  (via drill 0.3)
  Top 0.152: v16.89,39.54 16.89,40.54 12.39,45.04 LED4.4
  Bottom 0.152: v16.89,39.54 15.89,39.54 RN3.4
PA_2  (via drill 0.3)
  Top 0.152: v58.51,7.91 62.01,7.91 64.14,5.79 CN10.35
  Bottom 0.152: v58.51,7.91 58.51,8.16 55.76,10.91 45.01,10.91 RN6.5 | SWITCH.9 52.51,47.04 53.14,47.04 54.26,48.16 63.39,48.16 64.01,47.54 67.14,47.54 68.14,46.54 68.14,8.16 66.89,6.91 65.39,6.91 64.26,5.79 CN10.35
PA_8  (via drill 0.3)
  Top 0.152: v49.51,26.41 57.14,26.41 57.64,26.91 57.64,27.04 | 57.64,27.04 57.64,28.04 54.14,31.54 54.14,32.54 52.51,34.16 SWITCH.14 | 57.64,27.04 v57.89,26.79
  Bottom 0.152: v49.51,26.41 42.01,18.91 42.01,16.16 42.76,15.41 43.01,15.41 RN5.6 | v57.89,26.79 58.26,27.16 59.14,27.16 59.64,26.66 59.64,26.54 64.14,22.04 64.14,21.04 CN10.23
PA_9  (via drill 0.3)
  Top 0.152: v50.89,27.16 56.39,27.16 56.64,27.41 | 56.64,27.41 56.89,27.66 56.89,28.16 53.39,31.66 52.51,31.66 SWITCH.15 | 56.64,27.41 v56.89,27.16
  Bottom 0.152: v50.89,27.16 50.89,26.79 42.39,18.29 42.39,16.54 42.76,16.16 43.01,16.16 RN5.7 | v56.89,27.16 57.26,27.54 60.39,27.54 64.14,23.79 64.14,23.54 CN10.21
PA_10  (via drill 0.3)
  Top 0.152: v57.01,8.66 63.89,8.66 64.14,8.41 CN10.33 64.26,8.41 65.26,9.41 66.76,9.41 68.51,11.16 68.51,41.04 67.14,42.41 64.01,42.41 63.01,43.41 63.01,46.16 61.26,47.91 59.01,47.91 55.64,44.54 52.51,44.54 SWITCH.10
  Bottom 0.152: v57.01,8.66 55.51,10.16 45.01,10.16 RN6.6
PB_3  (via drill 0.3)
  Top 0.152: v55.26,9.41 62.76,9.41 64.14,10.79 CN10.31 64.26,10.91 65.26,11.91 66.76,11.91 68.14,13.29 68.14,38.91 67.14,39.91 62.76,39.91 60.64,37.79 58.26,37.79 54.26,41.79 52.51,41.79 SWITCH.11
  Bottom 0.152: v55.26,9.41 45.01,9.41 RN6.7
PB_4  (via drill 0.3)
  Top 0.152: v50.14,8.66 53.26,11.79 60.01,11.79 64.14,15.91 CN10.27 | v58.89,32.91 52.51,39.29 SWITCH.12
  Bottom 0.152: v50.14,8.66 45.01,8.66 RN6.8 | v58.89,32.91 61.01,32.91 63.01,30.91 63.01,30.79 64.14,29.66 67.14,29.66 67.76,29.04 67.76,18.04 66.76,17.04 65.39,17.04 64.26,15.91 CN10.27
PB_10  (via drill 0.3)
  Top 0.152: v44.76,12.79 54.76,12.79 55.39,12.16 59.01,12.16 63.01,16.16 63.01,17.29 64.14,18.41 CN10.25 | v58.64,26.16 58.64,27.04 58.51,27.16 58.51,30.29 52.51,36.29 52.51,36.79 SWITCH.13
  Bottom 0.152: v44.76,12.79 43.14,14.41 RN5.5 | v58.64,26.16 58.64,25.91 63.01,21.54 63.01,19.66 64.14,18.54 CN10.25
PC_7  (via drill 0.3)
  Top 0.152: v56.14,27.91 53.76,27.91 52.51,29.16 SWITCH.16
  Bottom 0.152: RN5.8 43.14,17.04 43.14,18.41 52.39,27.66 52.39,29.16 SWITCH.16 | v56.14,27.91 60.76,27.91 62.51,26.16 64.14,26.16 CN10.19
POT
  Top 0.152: CN7.28 5.76,15.91 5.76,14.91 7.64,13.04 7.64,2.41 8.26,1.79 51.76,1.79 55.39,5.41 57.14,5.41 POT.2
SCL  (via drill 0.3)
  Top 0.152: v49.51,23.41 v40.26,14.16
  Bottom 0.152: v40.26,14.16 39.76,13.66 39.01,13.66 PCA9685.26 | v49.51,23.41 49.51,24.16 54.14,28.79 54.14,47.41 54.51,47.79 55.76,47.79 56.64,46.91 R1.2 56.76,46.79 57.64,45.91 61.14,45.91 61.51,46.29 64.14,46.29 CN10.3
SDA  (via drill 0.3)
  Top 0.152: v41.39,13.04 42.26,13.04 51.76,22.54 v55.14,22.54
  Bottom 0.152: v41.39,13.04 39.01,13.04 PCA9685.27 | v55.14,22.54 55.14,24.54 55.39,24.79 55.39,42.91 55.89,43.41 | 55.89,43.41 56.64,44.16 R2.2 | 55.89,43.41 61.14,43.41 61.51,43.79 64.14,43.79 CN10.5
VCC  (via drill 0.3)
  Top 0.152: SWITCH.5 60.14,39.41 60.14,41.79 SWITCH.6 60.14,41.91 60.14,44.41 SWITCH.7 60.14,44.54 60.14,46.91 SWITCH.8 | LED3.2 9.51,38.54 9.51,45.04 LED4.2 | LED1.2 9.39,31.54 LED2.2 9.51,31.66 9.51,32.66 v13.51,36.66 | B3.3 9.51,2.91 15.89,2.91 B3.4 16.01,2.91 17.39,2.91 19.64,5.16 v21.01,5.16 | SERVO.2 25.14,25.29 25.14,20.66 29.01,16.79 29.01,14.66 26.14,11.79 B2.4 | v45.01,13.79 43.64,13.79 42.14,12.29 v40.14,12.29
  Bottom 0.152: 55.14,45.16 55.14,46.79 R1.1 | 55.14,45.16 55.14,44.29 R2.1 55.01,44.16 55.01,25.04 52.51,22.54 52.51,19.79 | 55.14,45.16 59.39,45.16 60.01,44.54 SWITCH.7 | 52.51,19.79 53.26,19.79 R5.2 | 52.51,19.79 50.89,19.79 R6.2 50.76,19.66 50.76,15.91 | 44.39,15.91 44.39,15.41 RN5.3 44.39,15.29 44.39,14.54 RN5.4 44.39,14.41 v45.01,13.79 | 44.39,15.91 44.39,16.04 RN5.2 | RN5.1 44.39,16.91 44.39,16.16 RN5.2 | 50.76,15.91 U2.7 53.64,15.91 53.64,16.54 | 50.76,15.91 44.39,15.91 | 44.39,15.91 RN5.2 | 53.64,16.54 53.64,17.16 U2.8 | 53.64,16.54 55.51,14.66 58.14,14.66 U2.3 58.26,14.54 58.76,14.54 59.76,13.54 59.76,2.91 POT.3 | 15.01,44.54 14.76,44.29 10.39,44.29 9.64,45.04 LED4.2 | 15.01,44.54 15.64,45.16 LED5.2 | 8.64,23.91 7.76,23.91 7.01,24.66 5.26,24.66 4.64,24.04 4.64,23.04 5.26,22.41 5.89,22.41 9.14,19.16 9.51,19.16 C3.2 | 8.64,23.91 9.39,24.66 LED1.2 | 15.01,44.54 18.39,41.16 18.39,40.04 16.89,38.54 15.39,38.54 v13.51,36.66 | 22.14,9.16 22.14,6.41 R13.2 22.14,6.29 v21.01,5.16 | 22.14,9.16 19.64,11.66 B2.3 19.51,11.79 16.14,15.16 13.39,15.16 R11.2 13.26,15.29 13.26,17.91 8.64,22.54 8.64,23.91 | 26.76,11.79 26.14,11.79 B2.4 26.76,11.79 | 26.76,11.79 33.64,11.79 34.14,12.29 38.89,12.29 PCA9685.28 39.01,12.29 v40.14,12.29 | 22.14,9.16 24.14,9.16 26.76,11.79

### Text on the board
tPlace: Fundamentals Embedded Software | v1.0